# Altium schematic sheet B38_RS485.SchDoc
size A4
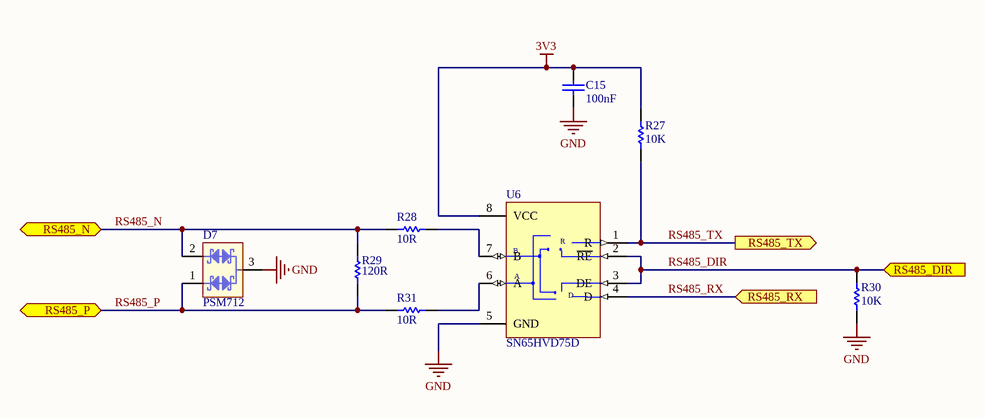
[diagram p0: B38_RS485.SchDoc]

## Parts
C15  100nF  [CAP0603]
D7  PSM712  [SOT-23]
R27  10K  [RES0603]
R28  10R  [RES0603]
R29  120R  [RES0603]
R30  10K  [RES0603]
R31  10R  [RES0603]
U6  SN65HVD75D  [SO-8N]

## Ports
RS485_DIR (in), RS485_N (bidir), RS485_P (bidir), RS485_RX (in), RS485_TX (out)

## Nets
3V3: C15.2 R27.2 U6.8(VCC)
GND: C15.1 D7.3(C) R30.2 U6.5(GND)
RS485_DIR: R30.1 U6.2(~{RE}) U6.3(DE) ; port RS485_DIR
RS485_N: D7.2(K) R28.2 R29.2 ; port RS485_N
RS485_P: D7.1(A) R29.1 R31.2 ; port RS485_P
RS485_RX: U6.4(D) ; port RS485_RX
RS485_TX: R27.1 U6.1(R) ; port RS485_TX
NetR28_1: R28.1 U6.7(B)
NetR31_1: R31.1 U6.6(A)

## Library data of the parts
C15 = Cap: Capacitor 10V, 10%; Manufacturer: Walsin; PN: 0603B104K100CT; Value: 100nF
D7 = PSM712: PSM712 is an asymmetrical transient voltage suppressor (TVS) array; PN: PSM712; Value: PSM712
R27 R30 = Res1: Resistor; Value: 10k
R28 R31 = Res1: Resistor 5%; Manufacturer: Panasonic; Value: 10Ω; PN: ERJ3GEYJ100V
R29 = Res1: Resistor; Manufacturer: Panasonic; Value: 120Ω
U6 = SN65HVD75D: RS-485/RS-422 Transceiver; PN: SN65HVD75D; Value: SN65HVD75D